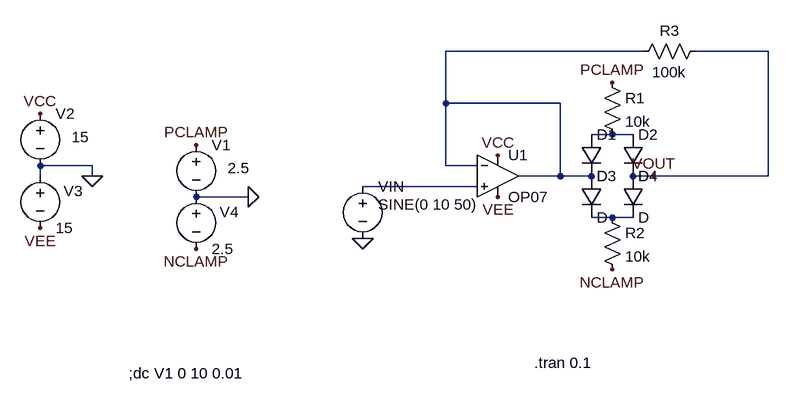
[diagram p0: schematic Draft16.asc]
Draft16.asc, the LTspice schematic file:
Version 4
SHEET 1 880 680
WIRE 208 -112 -96 -112
WIRE 400 -112 288 -112
WIRE -96 -32 -96 -112
WIRE 80 -32 -96 -32
WIRE 160 16 128 16
WIRE 192 16 160 16
WIRE -640 64 -720 64
WIRE -96 64 -96 -32
WIRE -48 64 -96 64
WIRE -720 80 -720 64
WIRE -640 80 -640 64
WIRE 80 80 80 -32
WIRE 80 80 16 80
WIRE 128 80 80 80
WIRE 224 80 192 80
WIRE 400 80 400 -112
WIRE 400 80 224 80
WIRE -48 96 -224 96
WIRE -400 112 -480 112
WIRE 160 144 128 144
WIRE 192 144 160 144
FLAG -640 80 0
FLAG 224 80 VOUT
FLAG -224 176 0
FLAG -720 -16 VCC
FLAG -720 160 VEE
FLAG -480 32 PCLAMP
FLAG -480 192 NCLAMP
FLAG -400 112 0
FLAG 160 -64 PCLAMP
FLAG 160 224 NCLAMP
FLAG -16 48 VCC
FLAG -16 112 VEE
SYMBOL voltage -224 80 R0
WINDOW 123 0 0 Left 0
WINDOW 39 0 0 Left 0
WINDOW 3 24 44 Left 2
SYMATTR Value SINE(0 10 50)
SYMATTR InstName VIN
SYMBOL voltage -720 -32 R0
WINDOW 123 0 0 Left 0
WINDOW 39 0 0 Left 0
WINDOW 3 48 52 Left 2
SYMATTR Value 15
SYMATTR InstName V2
SYMBOL voltage -720 64 R0
WINDOW 123 0 0 Left 0
WINDOW 39 0 0 Left 0
WINDOW 0 36 39 Left 2
SYMATTR InstName V3
SYMATTR Value 15
SYMBOL diode 112 16 R0
SYMATTR InstName D1
SYMBOL diode 176 16 R0
SYMATTR InstName D2
SYMBOL diode 112 80 R0
SYMATTR InstName D3
SYMBOL diode 176 80 R0
SYMATTR InstName D4
SYMBOL res 144 -80 R0
SYMATTR InstName R1
SYMATTR Value 10k
SYMBOL res 144 128 R0
SYMATTR InstName R2
SYMATTR Value 10k
SYMBOL voltage -480 16 R0
WINDOW 123 0 0 Left 0
WINDOW 39 0 0 Left 0
WINDOW 3 48 52 Left 2
SYMATTR Value 2.5
SYMATTR InstName V1
SYMBOL voltage -480 96 R0
WINDOW 123 0 0 Left 0
WINDOW 39 0 0 Left 0
WINDOW 0 36 39 Left 2
SYMATTR InstName V4
SYMATTR Value 2.5
SYMBOL OpAmps\\OP07 -16 16 R0
SYMATTR InstName U1
SYMBOL res 304 -128 R90
WINDOW 0 0 56 VBottom 2
WINDOW 3 32 56 VTop 2
SYMATTR InstName R3
SYMATTR Value 100k
TEXT -584 384 Left 2 !;dc V1 0 10 0.01
TEXT 40 368 Left 2 !.tran 0.1

The netlist it stands for:
* Draft16.asc
VIN N003 0 SINE(0 10 50)
V2 VCC 0 15
V3 0 VEE 15
D1 N002 N001 D
D2 N002 VOUT D
D3 N001 N004 D
D4 VOUT N004 D
R1 PCLAMP N002 10k
R2 N004 NCLAMP 10k
V1 PCLAMP 0 2.5
V4 0 NCLAMP 2.5
XU1 N003 N001 VCC VEE N001 LT1001  ; OP07, pins In+ In- V+ V- OUT
R3 VOUT N001 100k
.model D D
.lib standard.dio
;dc V1 0 10 0.01
.tran 0.1
.lib LTC.lib
.backanno
.end